# Altium schematic sheet VCXO_25M_DDMTD.SchDoc: SPEC-A7
size 420 x 297 mm; Author: G.Kasprowicz; CompanyName: WUT ISE; DrawnBy: G.Kasprowicz; Organization: WUT ISE; Address1: PW ISE; Address2: Nowowiejska 15/19 00-665 Warsaw; Address3: gkasprow@gmail.com; Revision: 2; SheetNumber: 7; SheetTotal: 18; ModifiedBy: -; CheckedDate: -; Title2: DDMTD VCXO; DivGrp: WUT ISE; Designer: G.Kasprowicz; ModifiedDate: -; ProjectName: Sensor Box
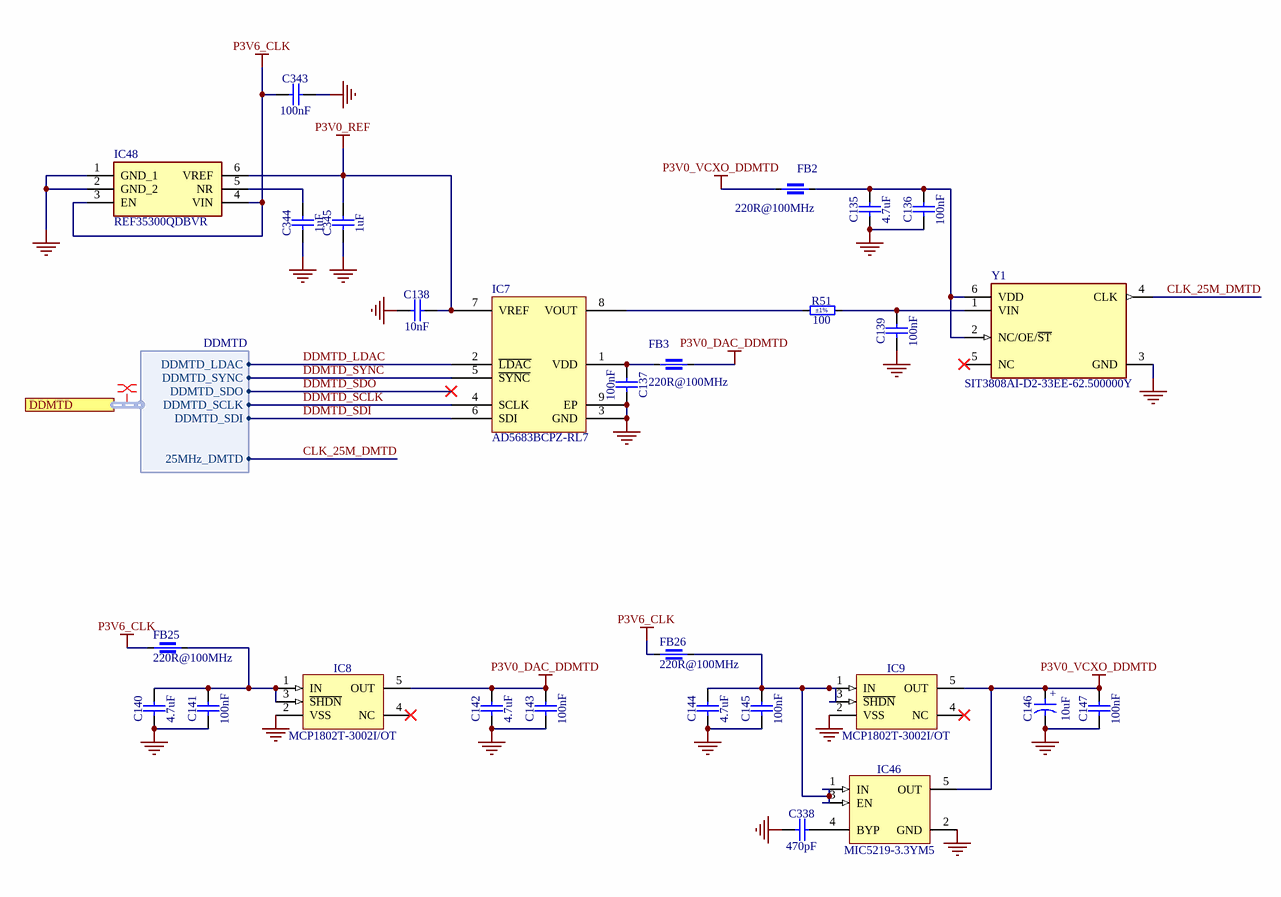
[diagram p0: VCXO_25M_DDMTD.SchDoc]

## Parts
C135  4.7uF  [CAPC1005X55N]
C136  100nF  [CAPC0603X33N]
C137  100nF  [CAPC0603X33N]
C138  10nF  [CAPC1005X55N]
C139  100nF  [CAPC2012X88N]
C140  4.7uF  [CAPC1005X55N]
C141  100nF  [CAPC0603X33N]
C142  4.7uF  [CAPC1005X55N]
C143  100nF  [CAPC0603X33N]
C144  4.7uF  [CAPC1005X55N]
C145  100nF  [CAPC0603X33N]
C146  10uF  [CAPMP3216X180N]
C147  100nF  [CAPC0603X33N]
C338  470pF  [CAPC1005X55N]
C343  100nF  [CAPC0603X33N]
C344  1uF  [CAPC1005X55N]
C345  1uF  [CAPC1005X55N]
FB2  220R@100MHz  [INDC1608X95N]
FB3  220R@100MHz  [INDC1608X95N]
FB25  220R@100MHz  [INDC1608X95N]
FB26  220R@100MHz  [INDC1608X95N]
IC7  AD5683BCPZ-RL7  [SON50P200X60_HS-9N]
IC8  MCP1802T-3002I/OT  [SOT95P270X145-5N]
IC9  MCP1802T-3002I/OT  [SOT95P270X145-5N]
IC46  MIC5219-3.3YM5  [SOT95P280X145-5N]
IC48  REF35300QDBVR  [SOT95P280X145-6N]
R51  100  Tolerance: ±1%  [RESC1005X40N]
Y1  SIT3808AI-D2-33EE-62.500000Y  [FP-SiT3808-D-MFG]

## Ports
DDMTD (harness DDMTD, see SPEC-A7-TOP[2C], FPGA_14_15[1E])

## Harnesses
DDMTD: DDMTD_LDAC, DDMTD_SYNC, DDMTD_SCLK, DDMTD_SDI, DDMTD_SDO, 25MHz_DMTD

## Nets
GND: C135.1 C136.1 C137.1 C138.1 C139.1 C140.1 C141.1 C142.1 C143.1 C144.1 C145.1 C146.2 C147.1 C338.1 C343.2 C344.1 C345.1 IC7.3(GND) IC7.9(EP) IC8.2(VSS) IC9.2(VSS) IC46.2(GND) IC48.1(GND_1) IC48.2(GND_2) Y1.3(GND)
P3V0_DAC_DDMTD: C142.2 C143.2 FB3.1 IC8.5(OUT)
P3V0_REF: C138.2 C345.2 IC7.7(VREF) IC48.6(VREF)
P3V0_VCXO_DDMTD: C146.1 C147.2 FB2.1 IC9.5(OUT) IC46.5(OUT)
P3V6_CLK: C343.1 FB25.2 FB26.2 IC48.3(EN) IC48.4(VIN)
CLK_25M_DMTD: Y1.4(CLK) ; port DDMTD.25MHz_DMTD
DDMTD_LDAC: IC7.2(~{LDAC}) ; port DDMTD.DDMTD_LDAC
DDMTD_SCLK: IC7.4(SCLK) ; port DDMTD.DDMTD_SCLK
DDMTD_SDI: IC7.6(SDI) ; port DDMTD.DDMTD_SDI
DDMTD_SDO: port DDMTD.DDMTD_SDO
DDMTD_SYNC: IC7.5(~{SYNC}) ; port DDMTD.DDMTD_SYNC
NetC135_2: C135.2 C136.2 FB2.2 Y1.2(NC/OE/~{ST}) Y1.6(VDD)
NetC137_2: C137.2 FB3.2 IC7.1(VDD)
NetC139_2: C139.2 R51.2 Y1.1(VIN)
NetC140_2: C140.2 C141.2 FB25.1 IC8.1(IN) IC8.3(~{SHDN})
NetC144_2: C144.2 C145.2 FB26.1 IC9.1(IN) IC9.3(~{SHDN}) IC46.1(IN) IC46.3(EN)
NetC338_2: C338.2 IC46.4(BYP)
NetC344_2: C344.2 IC48.5(NR)
NetIC7_8: IC7.8(VOUT) R51.1

Not connected (* = marked no-connect by the designer): IC8 4(NC)*; IC9 4(NC)*; Y1 5(NC)*

## Layout directives
net class DDMTD: (no net found under the mark)

## Notes on the sheet
- Project/Equipment
- Document
- Designer
- Drawn by
- Check.by
- Copyright WUT ISE 2024.
  This documentation describes Open Hardware and is licensed under the CERN OHL v.2. You may redistribute and modify this documentation under the terms of the CERN OHL v.2. (http://ohwr.org/CERNOHL). This documentation is distributed WITHOUT ANY EXPRESS OR IMPLIED WARRANTY, INCLUDING OF MERCHANTABILITY, SATISFACTORY QUALITY AND FITNESS FOR A PARTICULAR PURPOSE. Please see the CERN OHL v.2 for applicable conditions.
- Contact
- File
- Last Mod.
- Print Date
- Sheet
- Size
- A3
- of
- Rev
- (in symbol CTE3216-18_10UF_10V_10%_LESR1800) +

## Library data of the parts
C135 C140 C142 C144 = CC0402_4.7UF_6.3V_20%_X5R: Non-polarised capacitor; Part Description: SMD Multilayer Chip Ceramic Capacitor; Manufacturer: GENERIC; Manufacturer1 Part Number: C1005X5R0J475M050BC; Voltage: 6.3V; TC: X5R; Tolerance: ±20%; Part Number: CC0402_4.7UF_6.3V_20%_X5R; Component Kind: Standard; Component Type: Standard; Pin Count: 2; Value: 4.7uF; Status: Preferred; Manufacturer Part Number: CC0402_4.7UF_6.3V_20%_X5R; Case: 0402; Mounted: Yes; Socket: No; SMD: Yes; Sense: No; Manufacturer1 Example: TDK; Manufacturer1 ComponentHeight: 0.65mm; HelpURL: \\cern.ch\dfs\Applications\Altium\Datasheets\CC0402_X5R_TDK_C.pdf; Author: CERN DEM JLC; CreateDate: 03.03.2015; LatestRevisionDate: 03.03.2015
C136 C137 C141 C143 C145 C147 C343 = CC0201_100NF_6.3V_10%_X5R: Non-polarised capacitor; Part Description: SMD Multilayer Chip Ceramic Capacitor; Manufacturer: GENERIC; Manufacturer1 Part Number: 02016D104KAT2A; Voltage: 6.3V; TC: X5R; Tolerance: ±10%; Part Number: CC0201_100NF_6.3V_10%_X5R; Component Kind: Standard; Component Type: Standard; Pin Count: 2; Value: 100nF; Status: Not Recommended; Manufacturer Part Number: CC0201_100NF_6.3V_10%_X5R; Case: 0201; Mounted: Yes; Socket: No; SMD: Yes; Sense: No; Manufacturer1 Example: AVX; Manufacturer1 ComponentHeight: 0.33mm; HelpURL: \\cern.ch\dfs\Applications\Altium\Datasheets\CC0201_X5R_AVX.pdf; Author: CERN DEM JLC; CreateDate: 03.12.2007; LatestRevisionDate: 03.12.2007
C138 = CC0402_10NF_16V_10%_X7R: Non-polarised capacitor; Part Description: SMD Multilayer Chip Ceramic Capacitor; Manufacturer: GENERIC; Manufacturer1 Part Number: 223878715636; Voltage: 16V; TC: X7R; Tolerance: ±10%; Part Number: CC0402_10NF_16V_10%_X7R; Component Kind: Standard; Component Type: Standard; Pin Count: 2; Value: 10nF; Status: Not Recommended; Manufacturer Part Number: CC0402_10NF_16V_10%_X7R; Case: 0402; Mounted: Yes; Socket: No; SMD: Yes; Sense: No; Manufacturer1 Example: PHYCOMP; Manufacturer1 ComponentHeight: 0.55mm; HelpURL: \\cern.ch\dfs\Applications\Altium\Datasheets\CC0402_X7R_PHYCOMP.pdf; Author: CERN DEM JLC; CreateDate: 03.12.2007; LatestRevisionDate: 03.12.2007
C139 = CC0805_100NF_50V_1%_NP0: Non-polarised capacitor; Part Description: SMD Multilayer Chip Ceramic Capacitor; Manufacturer: GENERIC; Manufacturer1 Part Number: 0805N103F500C; Voltage: 50V; TC: C0G/NP0; Tolerance: ±1%; Part Number: CC0805_100NF_50V_1%_NP0; Component Kind: Standard; Component Type: Standard; Footprint: CAPC2012X135N; Pin Count: 2; Value: 100nF; Status: Not Recommended; Manufacturer Part Number: CC0805_100NF_50V_1%_NP0; Case: 0805; Mounted: Yes; Socket: No; SMD: Yes; Sense: No; Manufacturer1 Example: WALSIN TECHNOLOGY CORPORATION; Manufacturer1 ComponentHeight: 1.35mm; HelpURL: \\cern.ch\dfs\Applications\Altium\Datasheets\CC0805_WALSIN_0805.pdf; Author: CERN DEM HF; CreateDate: 28.08.2023; LatestRevisionDate: 28.08.2023; ComponentHeight: 1.35mm
C146 = CTE3216-18_10UF_10V_10%_LESR1800: Polarised capacitor; Part Description: Low ESR 1R8 Solid Tantalum Chip Capacitor; Manufacturer: GENERIC; Manufacturer1 Part Number: TPSA106K010R1800; Voltage: 10V; Tolerance: ±10%; Part Number: CTE3216-18_10UF_10V_10%_LESR1800; Component Kind: Standard; Component Type: Standard; Pin Count: 2; Value: 10uF; Status: Preferred; Manufacturer Part Number: CTE3216-18_10UF_10V_10%_LESR1800; Case: A; Mounted: Yes; Socket: No; SMD: Yes; Sense: No; Manufacturer1 Example: AVX; Manufacturer1 ComponentHeight: 1.8mm; HelpURL: \\cern.ch\dfs\Applications\Altium\Datasheets\CTE-LESR_AVX_TPS.pdf; Author: CERN DEM JLC; CreateDate: 05.05.2008; LatestRevisionDate: 20.01.2009
C338 = CC0402_470PF_50V_10%_X7R: Non-polarised capacitor; Part Description: SMD Multilayer Chip Ceramic Capacitor; Manufacturer: GENERIC; Manufacturer1 Part Number: 223858715618; Voltage: 50V; TC: X7R; Tolerance: ±10%; Part Number: CC0402_470PF_50V_10%_X7R; Component Kind: Standard; Component Type: Standard; Pin Count: 2; Value: 470pF; Status: Not Recommended; Manufacturer Part Number: CC0402_470PF_50V_10%_X7R; Case: 0402; Mounted: Yes; Socket: No; SMD: Yes; Sense: No; Manufacturer1 Example: PHYCOMP; Manufacturer1 ComponentHeight: 0.55mm; HelpURL: \\cern.ch\dfs\Applications\Altium\Datasheets\CC0402_NP0_PHYCOMP.pdf; Author: CERN DEM JLC; CreateDate: 03.12.2007; LatestRevisionDate: 03.12.2007
C344 C345 = CC0402_1UF_16V_10%_X5R: Non-polarised capacitor; Part Description: SMD Multilayer Chip Ceramic Capacitor; Manufacturer: GENERIC; Manufacturer1 Part Number: C1005X5R1C105KT; Voltage: 16V; TC: X5R; Tolerance: ±10%; Part Number: CC0402_1UF_16V_10%_X5R; Component Kind: Standard; Component Type: Standard; Pin Count: 2; Value: 1uF; Status: Preferred; Manufacturer Part Number: CC0402_1UF_16V_10%_X5R; Case: 0402; Mounted: Yes; Socket: No; SMD: Yes; Sense: No; Manufacturer1 Example: TDK; Manufacturer1 ComponentHeight: 0.55mm; HelpURL: \\cern.ch\dfs\Applications\Altium\Datasheets\CC0402_X5R_TDK_C.pdf; Author: CERN DEM JLC; CreateDate: 25.10.2012; LatestRevisionDate: 25.10.2012
FB2 FB3 FB25 FB26 = IND0603_MURATA_BLM18SG221TN1: Part Description: SMD EMIFIL Suppression Chip Ferrite Bead; Manufacturer: MURATA; Tolerance: ±25%; Power: 2.5A; Resistance: 0.04R; Part Number: IND0603_MURATA_BLM18SG221TN1; Component Kind: Standard; Component Type: Standard; Pin Count: 2; Value: 220R@100MHz; Manufacturer Part Number: BLM18SG221TN1; Case: 0603; Mounted: Yes; Socket: No; SMD: Yes; Sense: No; ComponentHeight: 0.95mm; HelpURL: \\cern.ch\dfs\Applications\Altium\Datasheets\IND0603_MURATA_BLM18S.pdf; Author: CERN DEM MR; CreateDate: 08.01.2016; LatestRevisionDate: 25.10.2018
IC7 = CMP-016-00740-2: IC DAC 16BIT V-OUT 8LFCSP 16 Bit Digital to Analog Converter 1 8-LFCSP-UD (2x2); Manufacturer: Analog Devices; Max Supply Voltage: 5.5V; Min Supply Voltage: 2.7V; Mounting Technology: Surface Mount; Max Operating Temperature: 105°C; Min Operating Temperature: -40°C; Pins: 8; Manufacturer Part Number: AD5683BCPZ-RL7
IC8 IC9 = MCP1802T-3002I/OT: 300mA, High PSRR, Low Quiescent Current LDO; Part Description: 3V, 300mA, High PSRR, Low Quiescent Current LDO; Manufacturer: MICROCHIP TECHNOLOGY; PressFit: No; Bonding: No; Part Number: MCP1802T-3002I/OT; Component Kind: Standard; Component Type: Standard; Device: MCP1802T-3002I/OT; PackageDescription: SOT, 0.95mm Pitch; 5 Pin,1.55mm W X 2.90mm L X 1.45mm H body, IPC Medium Density; Manufacturer Part Number: MCP1802T-3002I/OT; Pin Count: 3; Case: SOT23-5; Mounted: Yes; Socket: No; SMD: Yes; Sense: No; ComponentHeight: 1.45mm; HelpURL: \\cern.ch\dfs\Applications\Altium\Datasheets\MCP1802T-3002I-OT.pdf; Author: CERN DEM JLC; CreateDate: 03.05.2012; LatestRevisionDate: 17.09.2014
IC46 = MIC5219-3.3YM5: 500mA Peak Output LDO Regulator; Part Description: 3.3V 500mA Peak Output Low Drop-Out  (LDO) Regulator; Manufacturer: MICROCHIP TECHNOLOGY; PressFit: No; Bonding: No; Part Number: MIC5219-3.3YM5; Component Kind: Standard; Component Type: Standard; Device: MIC5219-3.3YM5; PackageDescription: SOT, 0.95mm pitch; 5 pin, 1.60mm W X 2.90mm L X 1.45mm H body, IPC Medium Density; Manufacturer Part Number: MIC5219-3.3YM5; Pin Count: 5; Case: SOT23-5; Mounted: Yes; Socket: No; SMD: Yes; Sense: No; ComponentHeight: 1.45mm; HelpURL: \\cern.ch\dfs\Applications\Altium\Datasheets\MIC5219-3.3YM5.pdf; Author: CERN DEM WB; CreateDate: 2019-04-16; LatestRevisionDate: 2019-04-16
IC48 = CMP-019-00159-1: "650-NA QUIESCENT CURRENT, 12-PPM" Series Voltage Reference IC Fixed 3V V ±0.05% 10 mA SOT-23-6; Case/Package: SOT-23; Pins: 6
R51 = R0402_100R_1%_0.0625W_100PPM: Resistor - 1%; Part Description: General Purpose Thick Film Chip Resistor; Manufacturer: GENERIC; Manufacturer1 Part Number: 232270671001L; TC: ±100ppm/°C; PressFit: No; Part Number: R0402_100R_1%_0.0625W_100PPM; Component Kind: Standard; Component Type: Standard; Pin Count: 2; Value: 100; Status: Not Recommended; Power: 0.0625W; Manufacturer Part Number: R0402_100R_1%_0.0625W_100PPM; Case: 0402; Mounted: Yes; Sense: No; Socket: No; SMD: Yes; Manufacturer1 Example: YAGEO PHYCOMP; Manufacturer1 ComponentHeight: 0.4mm; HelpURL: \\cern.ch\dfs\Applications\Altium\Datasheets\R0402_Phycomp_RC0402.pdf; Author: CERN DEM JLC; CreateDate: 03.12.2007; LatestRevisionDate: 17.10.2012
Y1 = CMP-25159-259533-1: MEMS OSC VCXO 62.500000MHZ LVCMOS